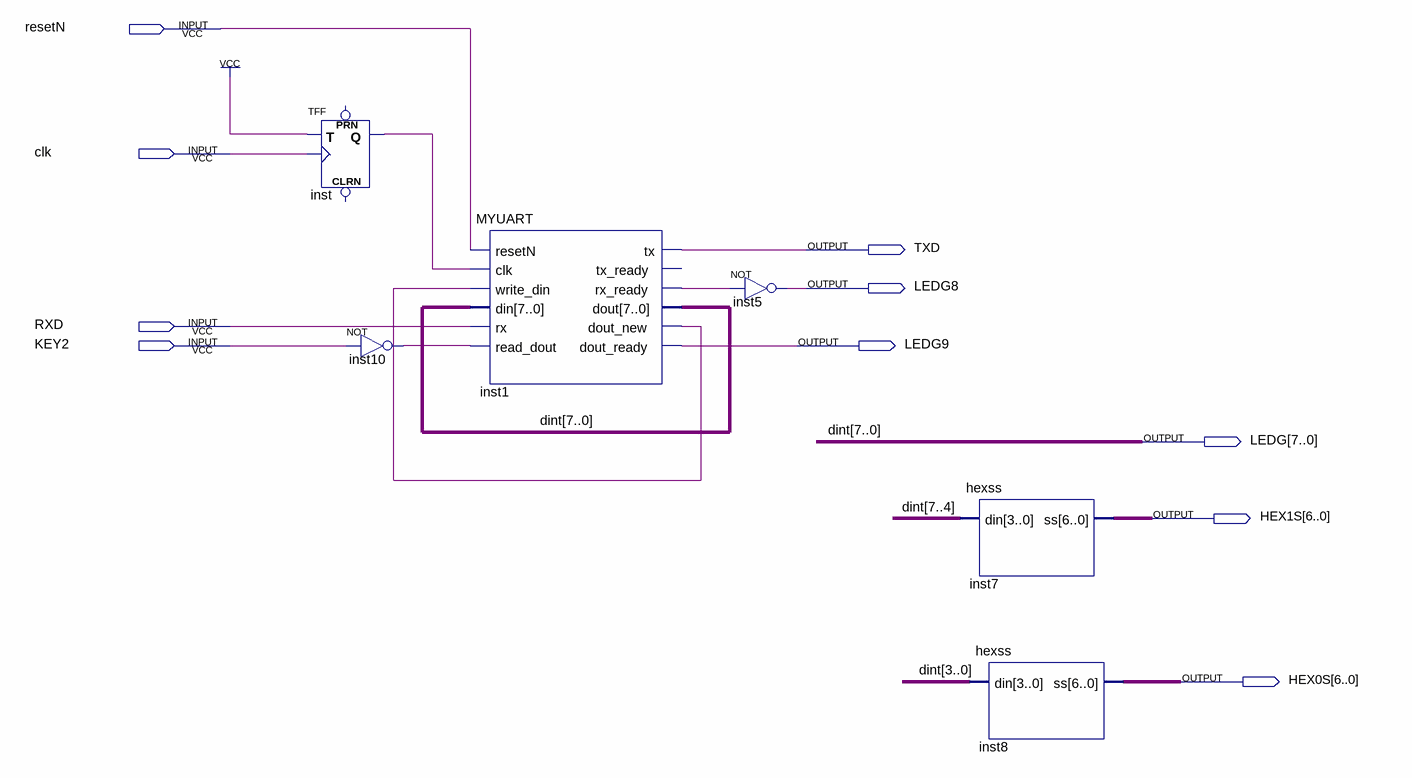
[diagram p0: schematic sheet]
// Quartus schematic UARTP.bdf as structural Verilog: 6 symbols, 10 pins
module UARTP (
  input  resetN,
  input  clk,
  input  RXD,
  input  KEY2,
  output TXD,
  output LEDG8,
  output LEDG9,
  output [7:0] LEDG,
  output [6:0] HEX1S,
  output [6:0] HEX0S
);

  wire inst1_dout_new, inst1_rx_ready, inst10_out, inst_q;

  TFF inst (.T(1'b1), .CLK(clk), .Q(inst_q));  // open: PRN, CLRN
  not inst10 (inst10_out, KEY2);
  MYUART inst1 (
    .resetN(resetN), .clk(inst_q), .write_din(inst1_dout_new), .din(LEDG), .rx(RXD), .read_dout(inst10_out),
    .tx(TXD), .rx_ready(inst1_rx_ready), .dout(LEDG), .dout_new(inst1_dout_new), .dout_ready(LEDG9));  // open: tx_ready
  not inst5 (LEDG8, inst1_rx_ready);
  hexss inst7 (.din(LEDG[7:4]), .ss(HEX1S));
  hexss inst8 (.din(LEDG[3:0]), .ss(HEX0S));

  // Other names for the same wires on the sheet: dint[7:0] = LEDG
endmodule
